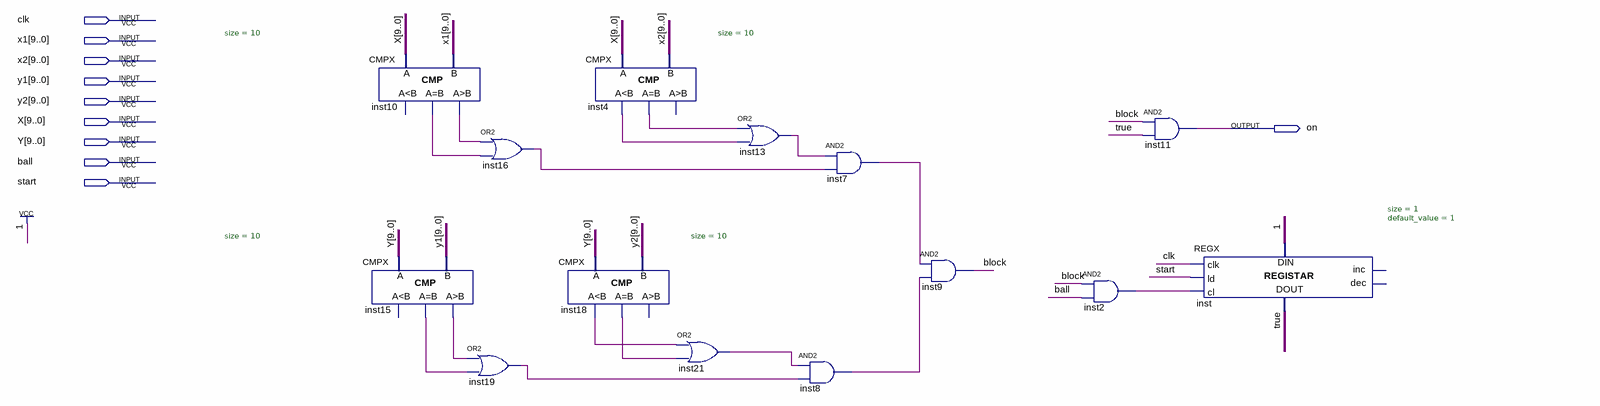
[diagram p0: schematic sheet]
// Quartus schematic Blok.bdf as structural Verilog: 14 symbols, 10 pins
module Blok (
  input  clk,
  input  [9:0] x1,
  input  [9:0] x2,
  input  [9:0] y1,
  input  [9:0] y2,
  input  [9:0] X,
  input  [9:0] Y,
  input  ball,
  input  start,
  output on
);

  wire block, inst2_out, inst4_eq, inst4_ls, inst7_out, inst8_out, inst10_eq, inst10_gr, inst13_out,
       inst15_eq, inst15_gr, inst16_out, inst18_eq, inst18_ls, inst19_out, inst21_out, true;

  CMPX #(.size(10)) inst10 (.A(X), .B(x1), .eq(inst10_eq), .gr(inst10_gr));  // open: ls
  CMPX #(.size(10)) inst15 (.A(Y), .B(y1), .eq(inst15_eq), .gr(inst15_gr));  // open: ls
  or inst16 (inst16_out, inst10_gr, inst10_eq);
  or inst19 (inst19_out, inst15_gr, inst15_eq);
  CMPX #(.size(10)) inst4 (.A(X), .B(x2), .ls(inst4_ls), .eq(inst4_eq));  // open: gr
  CMPX #(.size(10)) inst18 (.A(Y), .B(y2), .ls(inst18_ls), .eq(inst18_eq));  // open: gr
  or inst21 (inst21_out, inst18_ls, inst18_eq);
  or inst13 (inst13_out, inst4_eq, inst4_ls);
  and inst8 (inst8_out, inst21_out, inst19_out);
  and inst7 (inst7_out, inst13_out, inst16_out);
  and inst9 (block, inst7_out, inst8_out);
  and inst2 (inst2_out, block, ball);
  and inst11 (on, block, true);
  REGX #(.size(1), .default_value(1)) inst (
    .clk(clk), .ld(start), .cl(inst2_out), .data_in(1'b1), .data_out(true));  // open: inc, dec
endmodule
